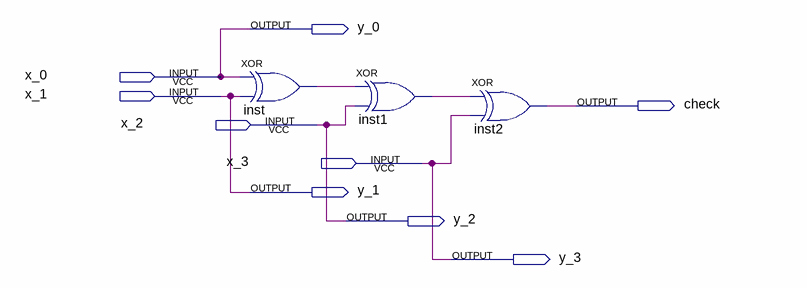
[diagram p0: schematic sheet]
// Quartus schematic coding_D.bdf as structural Verilog: 3 symbols, 9 pins
module coding_D (
  input  x_0,
  input  x_1,
  input  x_2,
  input  x_3,
  output y_0,
  output check,
  output y_1,
  output y_2,
  output y_3
);

  wire inst1_out, inst_out;

  xor inst (inst_out, x_0, x_1);
  xor inst1 (inst1_out, inst_out, x_2);
  xor inst2 (check, inst1_out, x_3);

  assign y_0 = x_0;
  assign y_1 = x_1;
  assign y_2 = x_2;
  assign y_3 = x_3;
endmodule
